# EAGLE design EEGAmp_Thruhole (EAGLE 9.6.2)
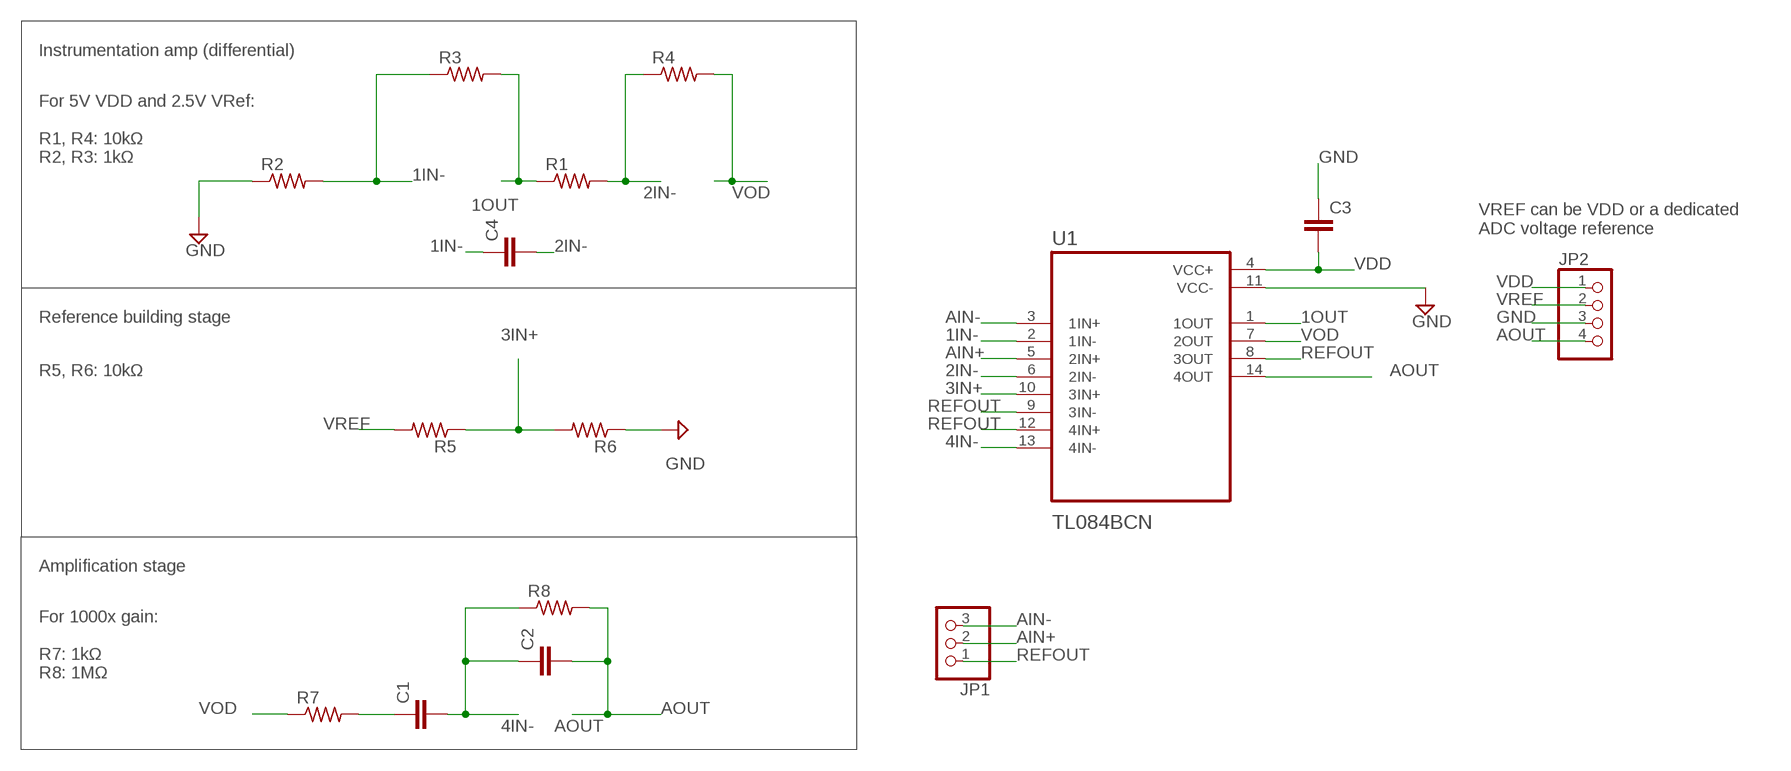
[diagram p0: schematic, sheet 1]

## Parts
C1  C2.5/2  [C2.5-2]
C2  C2.5/2  [C2.5-2]
C3  C2.5/2  [C2.5-2]
C4  C2.5/2  [C2.5-2]
JP1  PINHD-1X3  [1X03]
JP2  PINHD-1X4  [1X04]
R1  R-US_0204/5  [0204/5]
R2  R-US_0204/5  [0204/5]
R3  R-US_0204/5  [0204/5]
R4  R-US_0204/5  [0204/5]
R5  R-US_0204/5  [0204/5]
R6  R-US_0204/5  [0204/5]
R7  R-US_0204/5  [0204/5]
R8  R-US_0204/5  [0204/5]
U1  TL084BCN  [DIP794W45P254L1969H508Q14]

## Nets
1IN-: C4.1 R2.2 R3.1 U1.2(1IN-)
1OUT: R1.1 R3.2 U1.1(1OUT)
2IN-: C4.2 R1.2 R4.1 U1.6(2IN-)
3IN+: R5.1 R6.2 U1.10(3IN+)
4IN-: C1.2 C2.1 R8.1 U1.13(4IN-)
AIN+: JP1.2 U1.5(2IN+)
AIN-: JP1.3 U1.3(1IN+)
AOUT: C2.2 JP2.4 R8.2 U1.14(4OUT)
GND: C3.1 JP2.3 R2.1 R6.1 U1.11(VCC-)
N$9: C1.1 R7.2
REFOUT: JP1.1 U1.8(3OUT) U1.9(3IN-) U1.12(4IN+)
VDD: C3.2 JP2.1 U1.4(VCC+)
VOD: R4.2 R7.1 U1.7(2OUT)
VREF: JP2.2 R5.2

## Notes on the sheet
- Instrumentation amp (differential)
- For 5V VDD and 2.5V VRef:
  
  R1, R4: 10kΩ
  R2, R3: 1kΩ
- VREF can be VDD or a dedicated
  ADC voltage reference
- Reference building stage
- R5, R6: 10kΩ
- Amplification stage
- For 1000x gain:
  
  R7: 1kΩ
  R8: 1MΩ

## Library data of the parts
C1-C4 = capacitor-wima:C: CAPACITOR naming: grid - package width
JP1 = pinhead:PINHD-1X3: PIN HEADER
JP2 = pinhead:PINHD-1X4: PIN HEADER
R1-R8 = rcl:R-US_: RESISTOR, American symbol; SPICEPREFIX: R
U1 = TL084BCN:TL084BCN: Check availability <https://pricing.snapeda.com/parts/TL084BCN/Texas%20Instruments/view-part?ref=eda>; AVAILABILITY: In Stock; CHECK_PRICES: https://www.snapeda.com/parts/TL084BCN/Texas+Instruments/view-part/?ref=eda; DESCRIPTION: Quad, 30-V, 3-MHz, 13-V/µs slew rate, 3-mV offset voltage, In to V+, JFET-input op amp; MF: Texas Instruments; MP: TL084BCN; PACKAGE: PDIP-14 Texas Instruments; PRICE: None; PURCHASE-URL: https://www.snapeda.com/api/url_track_click_mouser/?unipart_id=565503&manufacturer=Texas Instruments&part_name=TL084BCN&search_term=tl084; SNAPEDA_LINK: https://www.snapeda.com/parts/TL084BCN/Texas+Instruments/view-part/?ref=snap

## Board
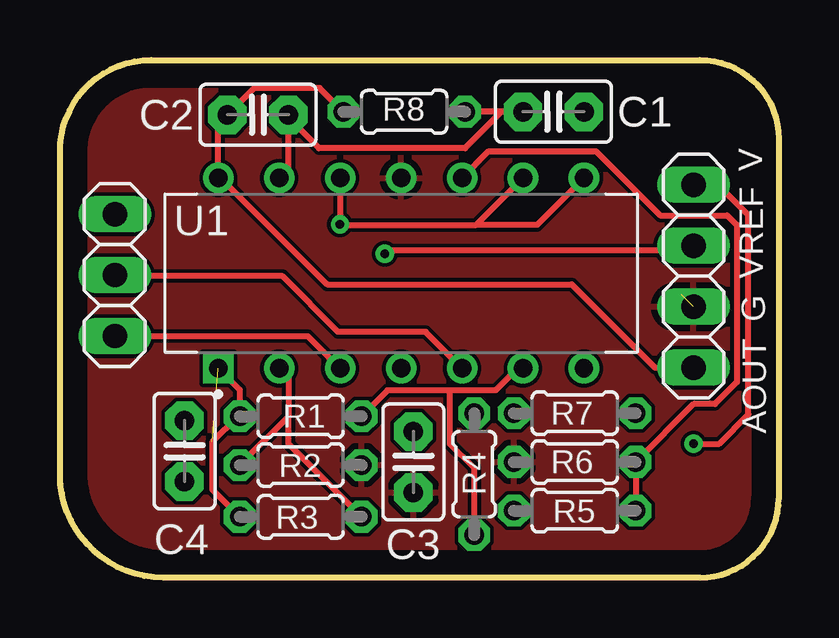
[diagram p1: board, top side]
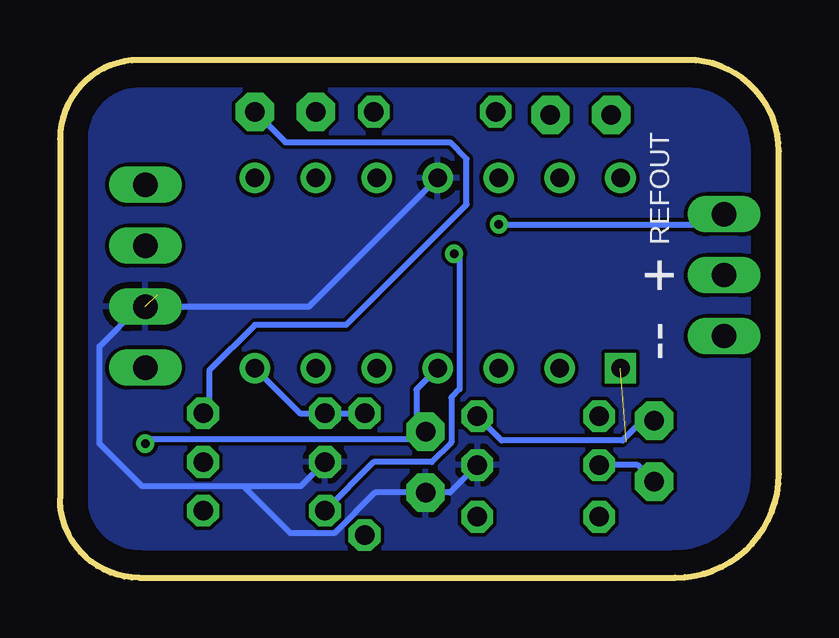
[diagram p2: board, bottom side, seen from below]

Size 29.97 x 21.59 mm. Coordinates in mm from the lower left corner, seen from the top.
Outline: 0,17.78 arc-90 3.81,21.59 26.67,21.59 arc-90 29.97,18.29 29.97,3.3 arc-90 26.67,0 4.32,0 arc-90 0,4.32 0,17.78
Copper layers (1*16): Top 0.035mm / dielectric 1.5mm / Bottom 0.035mm
Design rules "default": minimum track width 6mil, minimum drill 0.35mm, track to track 6mil, track to pad 6mil, pad to pad 6mil, via to via 6mil, smd to smd 6mil, copper to edge 40mil, drill to drill 6mil, minimum pad ring 10mil, minimum via ring 8mil, stop-mask expansion 4mil, vias tented up to drill 0mil, thermal gap 10mil

### Footprints (pad centres in the part's own frame; a part is rotated, then mirrored left to right if it is on the bottom)
C2.5-2 = drill 0.813 pad 1.6 octagon: 1 -1.27,0; 2 1.27,0
1X03 = drill 1.016 long: 1 -2.54,0; 2 0,0; 3 2.54,0
1X04 = drill 1.016 long: 1 -3.81,0; 2 -1.27,0; 3 1.27,0; 4 3.81,0
0204/5 = drill 0.813 octagon: 1 -2.54,0; 2 2.54,0
DIP794W45P254L1969H508Q14 = drill 0.77 pad 1.17 square: 1 -3.97,7.62 | drill 0.77 pad 1.17: 2 -3.97,5.08; 3 -3.97,2.54; 4 -3.97,0; 5 -3.97,-2.54; 6 -3.97,-5.08; 7 -3.97,-7.62; 8 3.97,-7.62; 9 3.97,-5.08; 10 3.97,-2.54; 11 3.97,0; 12 3.97,2.54; 13 3.97,5.08; 14 3.97,7.62

### Placement (x,y rotation side)
C1  20.57,19.43 180 top
C2  8.26,19.3 180 top
C3  14.73,4.83 90 top
C4  5.2,5.28 90 top
JP1  2.29,12.62 270 top
JP2  26.42,12.57 270 top
R1  10.03,6.73 0 top
R2  10.03,4.7 180 top
R3  10.03,2.54 180 top
R4  17.27,4.32 90 top
R5  21.46,2.79 180 top
R6  21.46,4.83 0 top
R7  21.46,6.86 0 top
R8  14.35,19.43 180 top
U1  14.22,12.7 90 top

### Tracks (layer width: path | path; a pad name or v marks a point on that pad's centre or on a via)
1IN-
  Top 0.254: U1.2 9.53,8.35 9.53,6.73 | 9.53,6.73 R2.2 | 9.53,6.73 9.53,5.59 R3.1
  Bottom 0.254: C4.1 5.88,4.7 R2.2
1OUT  (1 unrouted)
  Top 0.254: U1.1 7.49,7.84 R1.1 7.43,6.73 6.35,5.65 6.35,3.68 R3.2
2IN-
  Top 0.254: U1.6 19.08,8.73 18.16,7.81 16.26,7.81 | R1.2 13.65,7.81 16.26,7.81 | R4.1 17.27,4.57 16.26,5.59 16.26,7.81
  Bottom 0.254: C4.2 5.69,6.55 6.52,5.72 11.56,5.72 R1.2
3IN+
  Top 0.254: U1.10 17.87,17.78 22.35,17.78 25.02,15.11 27.82,15.11 28.22,14.71 28.22,8.15 27.3,7.24 26.42,7.24 R6.2 R5.1
4IN-
  Top 0.254: U1.13 9.53,17.05 C2.1 9.53,19.18 10.79,17.91 16.89,17.91 18.41,19.43 C1.2 R8.1
AIN+
  Top 0.254: U1.5 15.24,10.25 11.59,10.25 9.27,12.57 2.34,12.57 JP1.2
AIN-
  Top 0.254: U1.3 10.33,10.08 JP1.3
AOUT
  Top 0.254: R8.2 10.83,20.42 8.1,20.42 C2.2 6.6,18.92 U1.14 6.7,16.67 11.14,12.23 21.34,12.23 24.81,8.76 JP2.4
GND  (1 unrouted)
  Top 0.254: 25.91,11.81 25.53,11.81
  Bottom 0.254: U1.11 19.59,11.3 JP2.3 26.67,11.3 28.32,9.65 28.32,5.59 26.54,3.81 22.32,3.81 | R6.1 19.93,3.82 19.93,3.81 22.32,3.81 | R2.1 13.72,3.56 C3.1 16.83,3.56 18.53,1.85 20.36,1.85 22.32,3.81
  pour Bottom: -0.89,26.92 30.86,26.92 30.86,12.7 30.86,-5.33 3.3,-5.33 -1.78,-5.33 -1.78,26.92
  pour Top: -2.03,26.92 30.99,26.92 30.99,-5.46 -2.03,-5.46
N$9
  Bottom 0.254: C1.1 20.57,18.16 13.71,18.16 13.02,17.46 13.02,15.56 18.04,10.54 21.84,10.54 23.75,8.64 23.75,7.11 R7.2
REFOUT  (via drill 0.35)
  Top 0.254: U1.8 19.89,14.71 17.35,14.71 | U1.9 17.35,14.71 | 17.35,14.71 11.66,14.71 v11.68,14.74 | U1.12 v11.68,14.74 | v11.68,14.74 v11.67,14.73
  Bottom 0.254: v11.67,14.73 2.71,14.73 JP1.1
VDD  (via drill 0.35)
  Top 0.254: JP2.1 27.43,16.38 28.7,15.11 28.7,6.81 27.48,5.59 v26.42,5.59
  Bottom 0.254: U1.4 15.11,7.84 15.11,6.48 C3.2 14.73,5.79 26.21,5.79 v26.42,5.59
VOD
  Bottom 0.254: R4.2 R7.1 19.97,6.86 U1.7
VREF  (via drill 0.35)
  Top 0.254: JP2.2 26.21,13.64 13.67,13.64 v13.54,13.51
  Bottom 0.254: R5.2 16.89,4.82 14.48,4.82 13.65,5.65 13.65,7.52 13.31,7.86 13.31,13.32 13.5,13.51 v13.54,13.51

### Text on the board
tNames: V | VREF | G | AOUT
bNames: REFOUT | + | --